# EAGLE design monoblink_pannel (EAGLE 9.0.0)
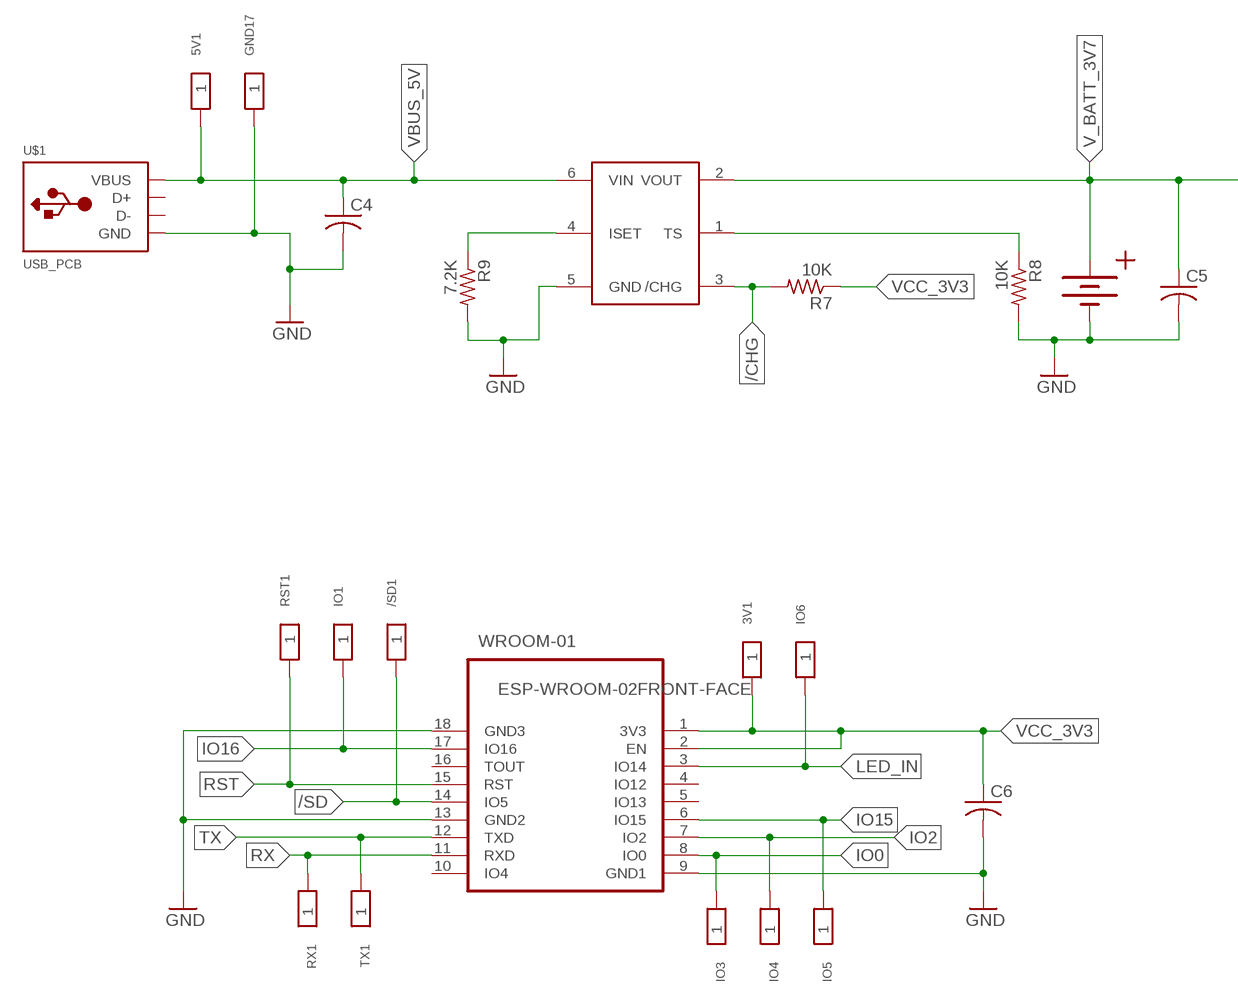
[diagram p0: schematic, sheet 1, part 1 of 2]
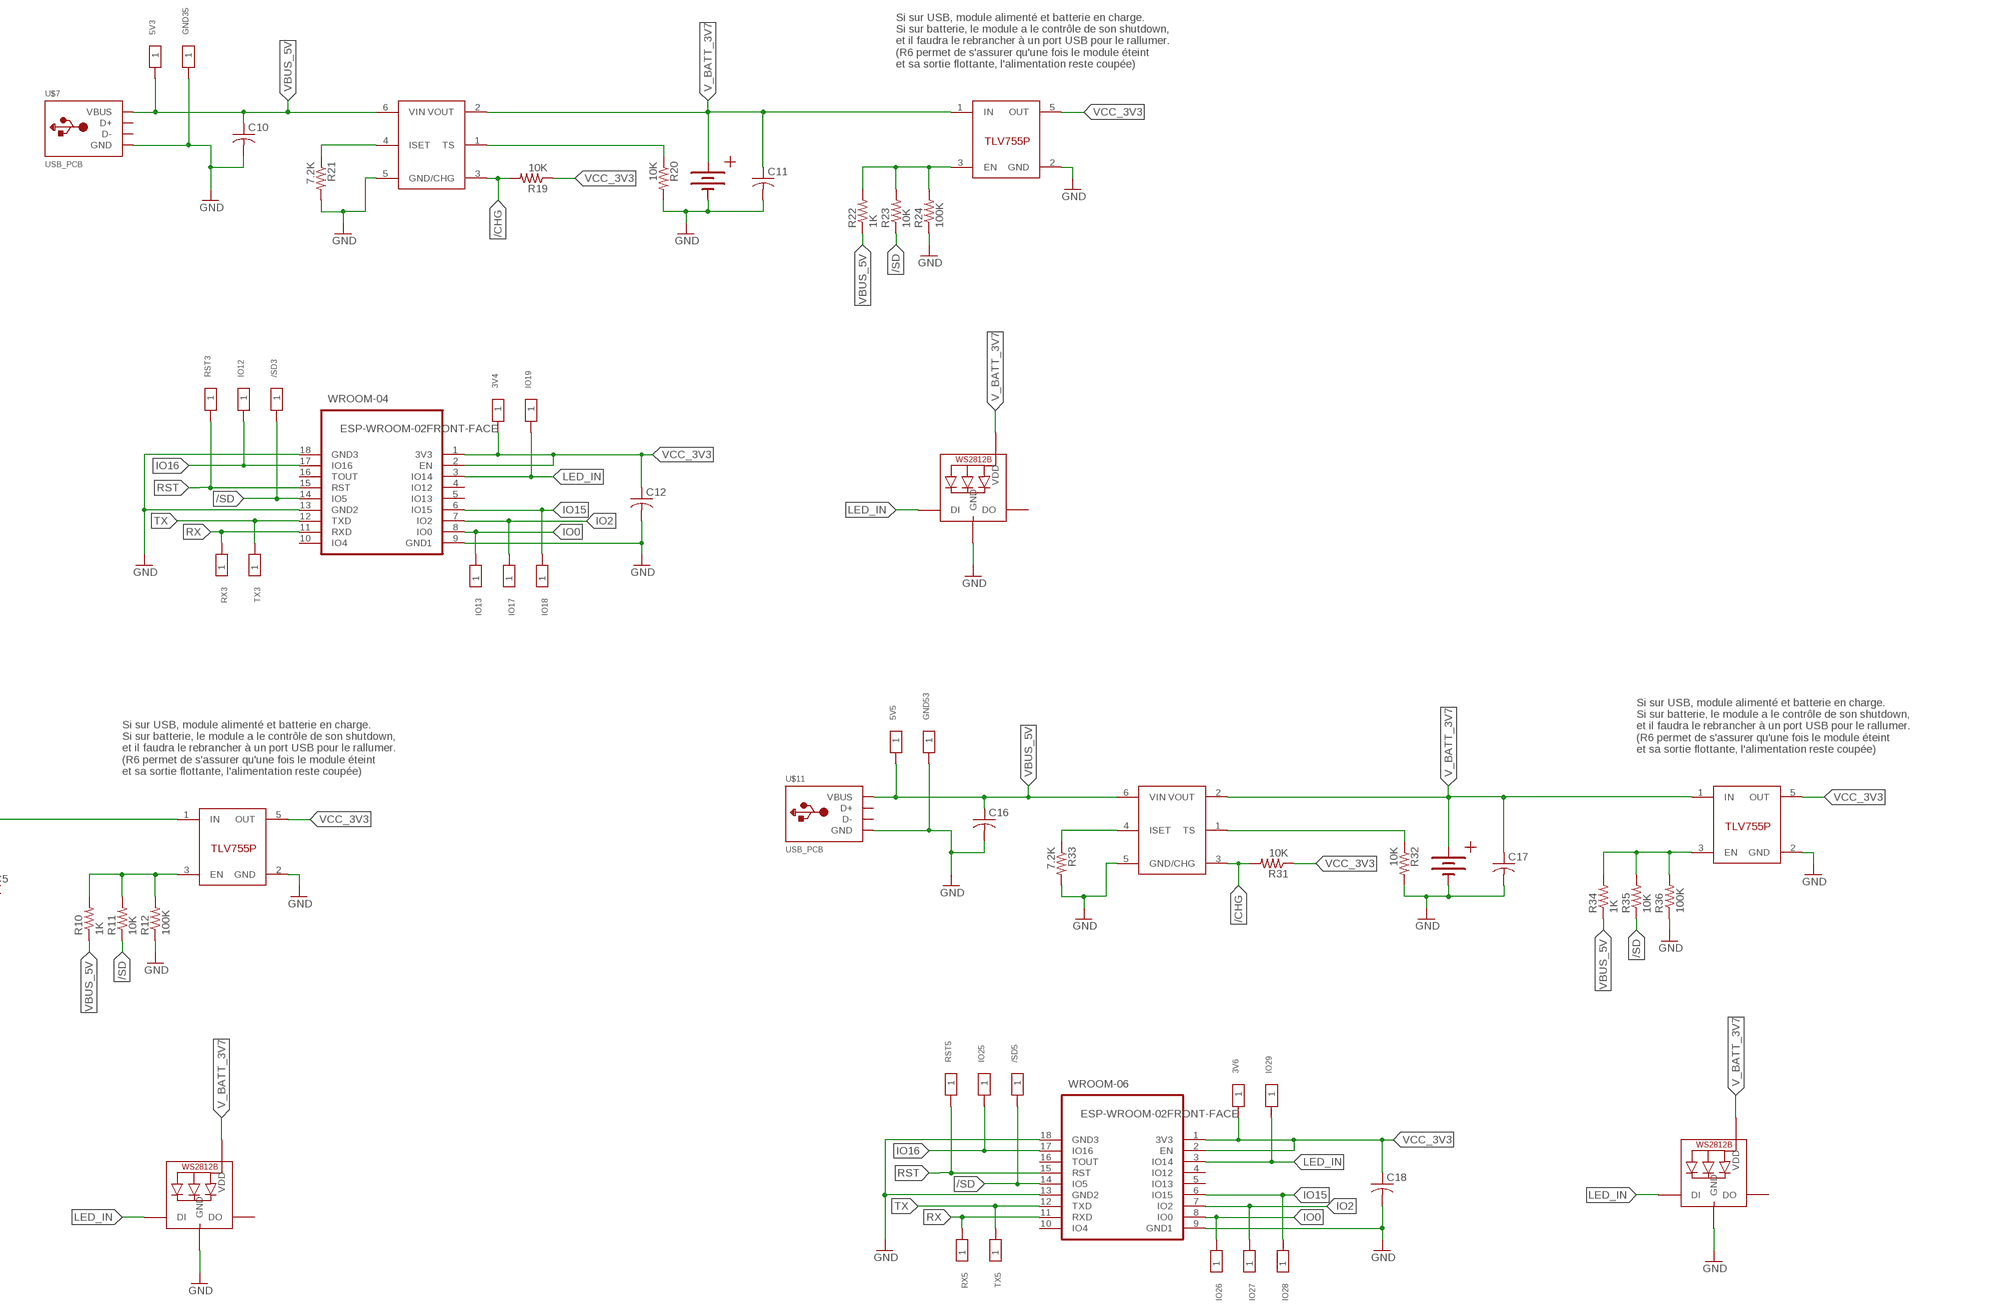
[diagram p1: schematic, sheet 1, part 2 of 2]

## Parts
3V1  TESTPAD_PROG  [TP1.5MM]
3V4  TESTPAD_PROG  [TP1.5MM]
3V6  TESTPAD_PROG  [TP1.5MM]
5V1  TESTPAD_PROG  [TP1.5MM]
5V3  TESTPAD_PROG  [TP1.5MM]
5V5  TESTPAD_PROG  [TP1.5MM]
/SD1  TESTPAD_PROG  [TP1.5MM]
/SD3  TESTPAD_PROG  [TP1.5MM]
/SD5  TESTPAD_PROG  [TP1.5MM]
C4  C-USC0603  [C0603]
C5  C-USC0603  [C0603]
C6  C-USC0603  [C0603]
C10  C-USC0603  [C0603]
C11  C-USC0603  [C0603]
C12  C-USC0603  [C0603]
C16  C-USC0603  [C0603]
C17  C-USC0603  [C0603]
C18  C-USC0603  [C0603]
CHG1  BQ21040  [SOT23-6]
CHG3  BQ21040  [SOT23-6]
CHG5  BQ21040  [SOT23-6]
GND17  TESTPAD_PROG  [TP1.5MM]
GND35  TESTPAD_PROG  [TP1.5MM]
GND53  TESTPAD_PROG  [TP1.5MM]
IO1  TESTPAD_PROG  [TP1.5MM]
IO3  TESTPAD_PROG  [TP1.5MM]
IO4  TESTPAD_PROG  [TP1.5MM]
IO5  TESTPAD_PROG  [TP1.5MM]
IO6  TESTPAD_PROG  [TP1.5MM]
IO12  TESTPAD_PROG  [TP1.5MM]
IO13  TESTPAD_PROG  [TP1.5MM]
IO17  TESTPAD_PROG  [TP1.5MM]
IO18  TESTPAD_PROG  [TP1.5MM]
IO19  TESTPAD_PROG  [TP1.5MM]
IO25  TESTPAD_PROG  [TP1.5MM]
IO26  TESTPAD_PROG  [TP1.5MM]
IO27  TESTPAD_PROG  [TP1.5MM]
IO28  TESTPAD_PROG  [TP1.5MM]
IO29  TESTPAD_PROG  [TP1.5MM]
LDO1  TLV755P  [SOT23-5]
LDO3  TLV755P  [SOT23-5]
LDO5  TLV755P  [SOT23-5]
LED1  WS2812B5050  [WS2812B]
LED3  WS2812B5050  [WS2812B]
LED5  WS2812B5050  [WS2812B]
R7  10K  R-US_R0603  [R0603]
R8  10K  R-US_R0603  [R0603]
R9  7.2K  R-US_R0603  [R0603]
R10  1K  R-US_R0603  [R0603]
R11  10K  R-US_R0603  [R0603]
R12  100K  R-US_R0603  [R0603]
R19  10K  R-US_R0603  [R0603]
R20  10K  R-US_R0603  [R0603]
R21  7.2K  R-US_R0603  [R0603]
R22  1K  R-US_R0603  [R0603]
R23  10K  R-US_R0603  [R0603]
R24  100K  R-US_R0603  [R0603]
R31  10K  R-US_R0603  [R0603]
R32  10K  R-US_R0603  [R0603]
R33  7.2K  R-US_R0603  [R0603]
R34  1K  R-US_R0603  [R0603]
R35  10K  R-US_R0603  [R0603]
R36  100K  R-US_R0603  [R0603]
RST1  TESTPAD_PROG  [TP1.5MM]
RST3  TESTPAD_PROG  [TP1.5MM]
RST5  TESTPAD_PROG  [TP1.5MM]
RX1  TESTPAD_PROG  [TP1.5MM]
RX3  TESTPAD_PROG  [TP1.5MM]
RX5  TESTPAD_PROG  [TP1.5MM]
TX1  TESTPAD_PROG  [TP1.5MM]
TX3  TESTPAD_PROG  [TP1.5MM]
TX5  TESTPAD_PROG  [TP1.5MM]
U$1  USB_PCB  [USB_PADS]
U$3  BATT  [BATT_CON]
U$7  USB_PCB  [USB_PADS]
U$8  BATT  [BATT_CON]
U$11  USB_PCB  [USB_PADS]
U$12  BATT  [BATT_CON]
WROOM-01  ESP-WROOM-02FRONT-FACE  [FRONT-FACE]
WROOM-04  ESP-WROOM-02FRONT-FACE  [FRONT-FACE]
WROOM-06  ESP-WROOM-02FRONT-FACE  [FRONT-FACE]

## Nets
/CHG: CHG1.3(/CHG) CHG3.3(/CHG) CHG5.3(/CHG) R7.2 R19.2 R31.2
/SD: /SD1.1 /SD3.1 /SD5.1 R11.1 R23.1 R35.1 WROOM-01.14(IO5) WROOM-04.14(IO5) WROOM-06.14(IO5)
EN1: LDO1.3(EN) R10.2 R11.2 R12.2
EN3: LDO3.3(EN) R22.2 R23.2 R24.2
EN5: LDO5.3(EN) R34.2 R35.2 R36.2
GND: C4.2 C5.2 C6.2 C10.2 C11.2 C12.2 C16.2 C17.2 C18.2 CHG1.5(GND) CHG3.5(GND) CHG5.5(GND) GND17.1 GND35.1 GND53.1 LDO1.2(GND) LDO3.2(GND) LDO5.2(GND) LED1.3-GND(GND) LED3.3-GND(GND) LED5.3-GND(GND) R8.2 R9.2 R12.1 R20.2 R21.2 R24.1 R32.2 R33.2 R36.1 U$1.GND U$3.V-(-) U$7.GND U$8.V-(-) U$11.GND U$12.V-(-) WROOM-01.9(GND1) WROOM-01.13(GND2) WROOM-01.18(GND3) WROOM-04.9(GND1) WROOM-04.13(GND2) WROOM-04.18(GND3) WROOM-06.9(GND1) WROOM-06.13(GND2) WROOM-06.18(GND3)
IO0: IO3.1 IO13.1 IO26.1 WROOM-01.8(IO0) WROOM-04.8(IO0) WROOM-06.8(IO0)
IO2: IO4.1 IO17.1 IO27.1 WROOM-01.7(IO2) WROOM-04.7(IO2) WROOM-06.7(IO2)
IO15: IO5.1 IO18.1 IO28.1 WROOM-01.6(IO15) WROOM-04.6(IO15) WROOM-06.6(IO15)
IO16: IO1.1 IO12.1 IO25.1 WROOM-01.17(IO16) WROOM-04.17(IO16) WROOM-06.17(IO16)
ISET1: CHG1.4(ISET) R9.1
ISET3: CHG3.4(ISET) R21.1
ISET5: CHG5.4(ISET) R33.1
LED_IN: IO6.1 IO19.1 IO29.1 LED1.4-DIN(DI) LED3.4-DIN(DI) LED5.4-DIN(DI) WROOM-01.3(IO14) WROOM-04.3(IO14) WROOM-06.3(IO14)
RST: RST1.1 RST3.1 RST5.1 WROOM-01.15(RST) WROOM-04.15(RST) WROOM-06.15(RST)
RX: RX1.1 RX3.1 RX5.1 WROOM-01.11(RXD) WROOM-04.11(RXD) WROOM-06.11(RXD)
TS1: CHG1.1(TS) R8.1
TS3: CHG3.1(TS) R20.1
TS5: CHG5.1(TS) R32.1
TX: TX1.1 TX3.1 TX5.1 WROOM-01.12(TXD) WROOM-04.12(TXD) WROOM-06.12(TXD)
V_BATT_3V7: C5.1 C11.1 C17.1 CHG1.2(VOUT) CHG3.2(VOUT) CHG5.2(VOUT) LDO1.1(IN) LDO3.1(IN) LDO5.1(IN) LED1.1-VDD(VDD) LED3.1-VDD(VDD) LED5.1-VDD(VDD) U$3.V+(+) U$8.V+(+) U$12.V+(+)
VBUS_5V: 5V1.1 5V3.1 5V5.1 C4.1 C10.1 C16.1 CHG1.6(VIN) CHG3.6(VIN) CHG5.6(VIN) R10.1 R22.1 R34.1 U$1.V_SUPPLY(VBUS) U$7.V_SUPPLY(VBUS) U$11.V_SUPPLY(VBUS)
VCC_3V3: 3V1.1 3V4.1 3V6.1 C6.1 C12.1 C18.1 LDO1.5(OUT) LDO3.5(OUT) LDO5.5(OUT) R7.1 R19.1 R31.1 WROOM-01.1(3V3) WROOM-01.2(EN) WROOM-04.1(3V3) WROOM-04.2(EN) WROOM-06.1(3V3) WROOM-06.2(EN)
Unconnected: LED1.2-DOUT(DO) LED3.2-DOUT(DO) LED5.2-DOUT(DO) U$1.D+ U$1.D- U$7.D+ U$7.D- U$11.D+ U$11.D- WROOM-01.4(IO12) WROOM-01.5(IO13) WROOM-01.10(IO4) WROOM-01.16(TOUT) WROOM-04.4(IO12) WROOM-04.5(IO13) WROOM-04.10(IO4) WROOM-04.16(TOUT) WROOM-06.4(IO12) WROOM-06.5(IO13) WROOM-06.10(IO4) WROOM-06.16(TOUT)

## Notes on the sheet
- Si sur USB, module alimenté et batterie en charge.
  Si sur batterie, le module a le contrôle de son shutdown,
  et il faudra le rebrancher à un port USB pour le rallumer.
  (R6 permet de s'assurer qu'une fois le module éteint
  et sa sortie flottante, l'alimentation reste coupée)
- Si sur USB, module alimenté et batterie en charge.
  Si sur batterie, le module a le contrôle de son shutdown,
  et il faudra le rebrancher à un port USB pour le rallumer.
  (R6 permet de s'assurer qu'une fois le module éteint
  et sa sortie flottante, l'alimentation reste coupée)
- Si sur USB, module alimenté et batterie en charge.
  Si sur batterie, le module a le contrôle de son shutdown,
  et il faudra le rebrancher à un port USB pour le rallumer.
  (R6 permet de s'assurer qu'une fois le module éteint
  et sa sortie flottante, l'alimentation reste coupée)

## Library data of the parts
3V1 3V4 3V6 5V1 5V3 5V5 /SD1 /SD3 /SD5 GND17 GND35 GND53 IO1 IO3-IO6 IO12 IO13 IO17-IO19 IO25-IO29 RST1 RST3 RST5 RX1 RX3 RX5 TX1 TX3 TX5 = monoblink_wifi:TESTPAD_PROG: TESTPAD
C4-C6 C10-C12 C16-C18 = monoblink_wifi:C-US: CAPACITOR, American symbol; SPICEPREFIX: C
CHG1 CHG3 CHG5 = monoblink_wifi:BQ21040
LDO1 LDO3 LDO5 = monoblink_wifi:TLV755P
LED1 LED3 LED5 = monoblink_wifi:WS2812B
R7-R12 R19-R24 R31-R36 = monoblink_wifi:R-US_: RESISTOR, American symbol; SPICEPREFIX: R
U$1 U$7 U$11 = monoblink_wifi:USB_PCB
U$3 U$8 U$12 = monoblink_wifi:BATT
WROOM-01 WROOM-04 WROOM-06 = monoblink_wifi:ESP-WROOM-02: WiFi module - ESP-WROOM-02

## Board
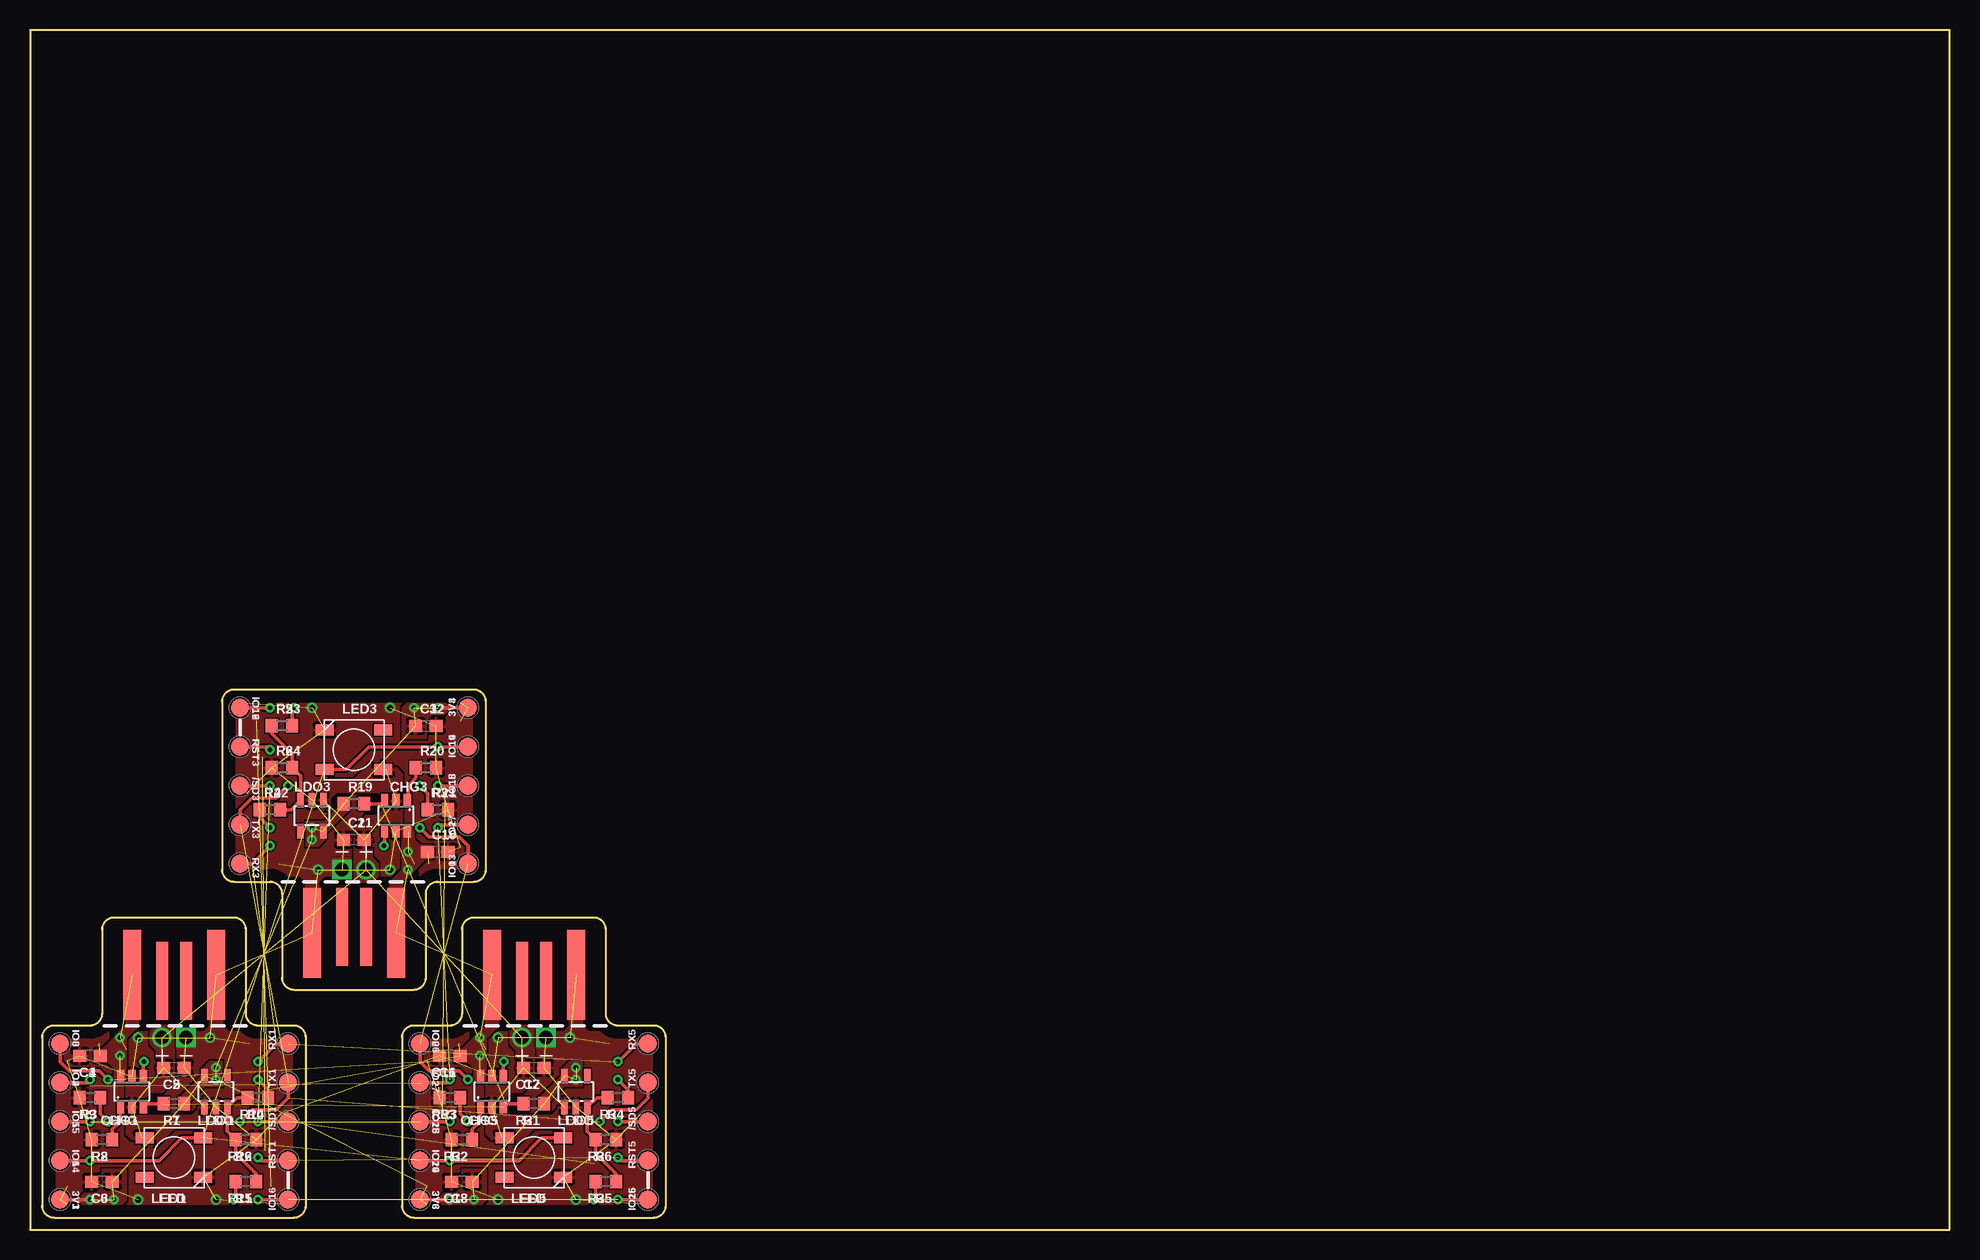
[diagram p2: board, top side]
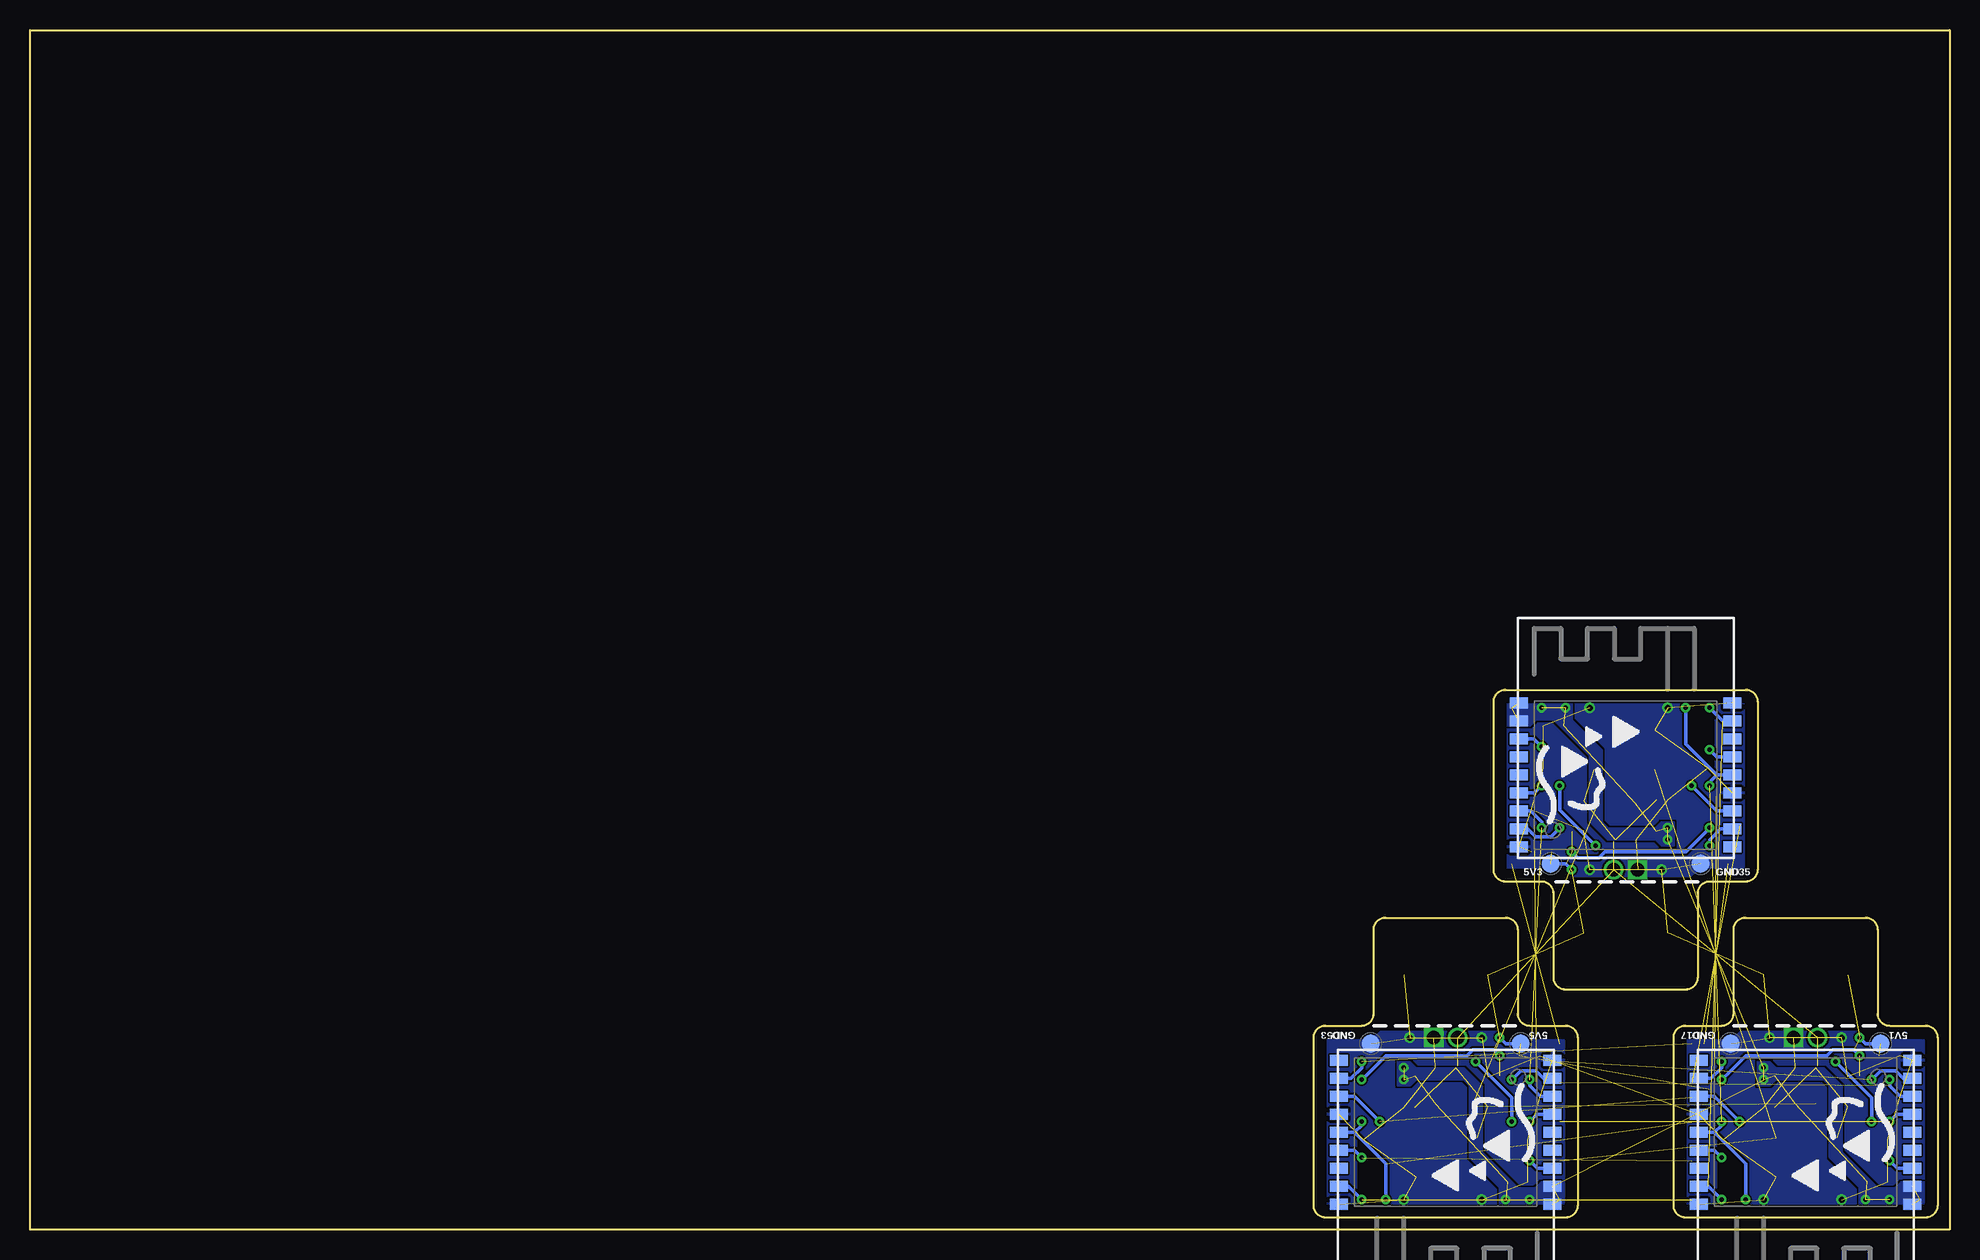
[diagram p3: board, bottom side, seen from below]

Size 160 x 100 mm. Coordinates in mm from the lower left corner, seen from the top.
Outline: 0,0 160,0 160,100 0,100 0,0
Outline: 2,17 arc90 1,16 1,2 arc90 2,1 22,1 arc90 23,2 23,16 arc90 22,17 19,17 arc-90 18,18 18,25 arc90 17,26 7,26 arc90 6,25 6,18 arc-90 5,17 2,17
Outline: 37,29 arc90 38,30 38,44 arc90 37,45 17,45 arc90 16,44 16,30 arc90 17,29 20,29 arc-90 21,28 21,21 arc90 22,20 32,20 arc90 33,21 33,28 arc-90 34,29 37,29
Outline: 32,17 arc90 31,16 31,2 arc90 32,1 52,1 arc90 53,2 53,16 arc90 52,17 49,17 arc-90 48,18 48,25 arc90 47,26 37,26 arc90 36,25 36,18 arc-90 35,17 32,17
Copper layers (1*16): Top 0.035mm / dielectric 1.5mm / Bottom 0.035mm
Design rules "default": minimum track width 6mil, minimum drill 0.35mm, track to track 6mil, track to pad 6mil, pad to pad 6mil, via to via 6mil, smd to smd 6mil, copper to edge 40mil, drill to drill 6mil, minimum pad ring 10mil, minimum via ring 8mil, stop-mask expansion 4mil, vias tented up to drill 0mil, thermal gap 10mil

### Footprints (pad centres in the part's own frame; a part is rotated, then mirrored left to right if it is on the bottom)
TP1.5MM = smd 1.5 x 1.5: 1 0,0
C0603 = smd 1.1 x 1: 1 -0.85,0; 2 0.85,0
SOT23-6 = smd 0.6 x 1.1: 1 -0.95,-1.25; 2 0,-1.25; 3 0.95,-1.25; 4 0.95,1.25; 5 0,1.25; 6 -0.95,1.25
SOT23-5 = smd 0.55 x 1.2: 1 -0.95,-1.3; 2 0,-1.3; 3 0.95,-1.3; 4 0.95,1.3; 5 -0.95,1.3
WS2812B = smd 1.5 x 0.9: 1-VDD 2.45,-1.65; 2-DOUT 2.45,1.65; 3-GND -2.45,1.65; 4-DIN -2.45,-1.65
R0603 = smd 1 x 1.1: 1 -0.85,0; 2 0.85,0
USB_PADS = smd 1 x 6.5: D+ 1,3.25; D- -1,3.25 | smd 1.5 x 7.5: GND 3.5,3.75; V_SUPPLY -3.5,3.75
BATT_CON = drill 1.1 pad 1.6: V+ 0,0 | drill 1.1 pad 1.6 square: V- 2,0
FRONT-FACE = smd 1.485 x 0.9: 1 -8.893,4.9; 2 -8.893,3.4; 3 -8.893,1.9; 4 -8.893,0.4; 5 -8.893,-1.1; 6 -8.893,-2.6; 7 -8.893,-4.1; 8 -8.893,-5.6; 9 -8.893,-7.1; 10 8.893,-7.1; 11 8.893,-5.6; 12 8.893,-4.1; 13 8.893,-2.6; 14 8.893,-1.1; 15 8.893,0.4; 16 8.893,1.9; 17 8.893,3.4; 18 8.893,4.9

### Placement (x,y rotation side)
3V1  2.5,2.5 180 top
3V4  36.5,43.5 0 top
3V6  32.5,2.5 180 top
5V1  5.75,15.5 180 bottom
5V3  33.25,30.5 0 bottom
5V5  35.75,15.5 180 bottom
/SD1  21.5,9 180 top
/SD3  17.5,37 0 top
/SD5  51.5,9 180 top
C4  5,14.5 180 top
C5  12,13.5 0 top
C6  6,4 180 top
C10  34,31.5 0 top
C11  27,32.5 180 top
C12  33,42 0 top
C16  35,14.5 180 top
C17  42,13.5 0 top
C18  36,4 180 top
CHG1  8.5,11.5 0 top
CHG3  30.5,34.5 180 top
CHG5  38.5,11.5 0 top
GND17  18.25,15.5 180 bottom
GND35  20.75,30.5 0 bottom
GND53  48.25,15.5 180 bottom
IO1  21.5,2.5 180 top
IO3  2.5,15.5 180 top
IO4  2.5,12.25 180 top
IO5  2.5,9 180 top
IO6  2.5,5.75 180 top
IO12  17.5,43.5 0 top
IO13  36.5,30.5 0 top
IO17  36.5,33.75 0 top
IO18  36.5,37 0 top
IO19  36.5,40.25 0 top
IO25  51.5,2.5 180 top
IO26  32.5,15.5 180 top
IO27  32.5,12.25 180 top
IO28  32.5,9 180 top
IO29  32.5,5.75 180 top
LDO1  15.5,11.5 0 top
LDO3  23.5,34.5 180 top
LDO5  45.5,11.5 0 top
LED1  12,6 180 top
LED3  27,40 0 top
LED5  42,6 180 top
R7  12,10.5 180 top
R8  6,7.5 180 top
R9  5,11 180 top
R10  19,11 180 top
R11  18,4 0 top
R12  18,7.5 180 top
R19  27,35.5 0 top
R20  33,38.5 0 top
R21  34,35 0 top
R22  20,35 0 top
R23  21,42 180 top
R24  21,38.5 0 top
R31  42,10.5 180 top
R32  36,7.5 180 top
R33  35,11 180 top
R34  49,11 180 top
R35  48,4 0 top
R36  48,7.5 180 top
RST1  21.5,5.75 180 top
RST3  17.5,40.25 0 top
RST5  51.5,5.75 180 top
RX1  21.5,15.5 180 top
RX3  17.5,30.5 0 top
RX5  51.5,15.5 180 top
TX1  21.5,12.25 180 top
TX3  17.5,33.75 0 top
TX5  51.5,12.25 180 top
U$1  12,17.5 0 top
U$3  11,16 0 top
U$7  27,28.5 180 top
U$8  28,30 180 top
U$11  42,17.5 0 top
U$12  41,16 0 top
WROOM-01  12,7 180 bottom
WROOM-04  27,39 0 bottom
WROOM-06  42,7 180 bottom

### Tracks (layer width: path | path; a pad name or v marks a point on that pad's centre or on a via)
/CHG  (2 unrouted)
  Top 0.305: R7.2 9.7,10.5 CHG1.3 | R19.2 29.3,35.5 CHG3.3 | R31.2 39.7,10.5 CHG5.3
/SD  (via drill 0.35)  (2 unrouted)
  Top 0.305: R11.1 17.15,2.85 v17,2.5 | /SD1.1 v19,9 | R23.1 21.85,43.15 v22,43.5 | /SD3.1 v20,37 | R35.1 47.15,2.85 v47,2.5 | /SD5.1 v49,9
  Bottom 0.305: v17,2.5 17,5.5 19.6,8.1 | 19.6,8.1 WROOM-01.14 | 19.6,8.1 19,8.7 v19,9 | v22,43.5 22,40.5 19.4,37.9 | 19.4,37.9 WROOM-04.14 | 19.4,37.9 20,37.3 v20,37 | v47,2.5 47,5.5 49.6,8.1 | 49.6,8.1 WROOM-06.14 | 49.6,8.1 49,8.7 v49,9
EN1
  Top 0.305: R10.2 17.25,11 LDO1.3 16.45,8.2 R12.2 17.15,6.35 18.85,4.65 R11.2
EN3
  Top 0.305: R22.2 21.75,35 LDO3.3 22.55,37.8 R24.2 21.85,39.65 20.15,41.35 R23.2
EN5
  Top 0.305: R34.2 47.25,11 LDO5.3 46.45,8.2 R36.2 47.15,6.35 48.85,4.65 R35.2
GND  (via drill 0.5 pad 0.7)  (56 unrouted)
  other vias: 15,16 15.5,2.5 9,2.5 9,16 24,30 23.5,43.5 30,43.5 30,30 45,16 45.5,2.5 39,2.5 39,16
  pour Top (rank 2): 22.5,1.5 1.5,1.5 1.5,16.5 6.5,16.5 6.5,15 17.5,15 17.5,16.5 22.5,16.5
  pour Bottom (rank 2, no thermals): 19.5,1.5 4.5,1.5 4.5,16.5 19.5,16.5
  pour Bottom (rank 2): 19.5,1.5 22.5,1.5 22.5,16.5 19.5,16.5
  pour Bottom (rank 2): 1.5,1.5 4.5,1.5 4.5,16.5 1.5,16.5
  pour Top (rank 2, no thermals): 17.5,16.5 17.5,15 6.5,15 6.5,16.5 14.5,16.5 15,17 15,17.5 16,17.5 16,17 16.5,16.5
  pour Top (rank 2): 16.5,44.5 37.5,44.5 37.5,29.5 32.5,29.5 32.5,31 21.5,31 21.5,29.5 16.5,29.5
  pour Bottom (rank 2, no thermals): 19.5,44.5 34.5,44.5 34.5,29.5 19.5,29.5
  pour Bottom (rank 2): 19.5,44.5 16.5,44.5 16.5,29.5 19.5,29.5
  pour Bottom (rank 2): 37.5,44.5 34.5,44.5 34.5,29.5 37.5,29.5
  pour Top (rank 2, no thermals): 21.5,29.5 21.5,31 32.5,31 32.5,29.5 24.5,29.5 24,29 24,28.5 23,28.5 23,29 22.5,29.5
  pour Top (rank 2): 52.5,1.5 31.5,1.5 31.5,16.5 36.5,16.5 36.5,15 47.5,15 47.5,16.5 52.5,16.5
  pour Bottom (rank 2, no thermals): 49.5,1.5 34.5,1.5 34.5,16.5 49.5,16.5
  pour Bottom (rank 2): 49.5,1.5 52.5,1.5 52.5,16.5 49.5,16.5
  pour Bottom (rank 2): 31.5,1.5 34.5,1.5 34.5,16.5 31.5,16.5
  pour Top (rank 2, no thermals): 47.5,16.5 47.5,15 36.5,15 36.5,16.5 44.5,16.5 45,17 45,17.5 46,17.5 46,17 46.5,16.5
IO0  (via drill 0.35)  (2 unrouted)
  Top 0.305: IO3.1 2.5,14 3.25,13.25 5.75,13.25 v6.5,12.5 | IO13.1 36.5,32 35.75,32.75 33.25,32.75 v32.5,33.5 | IO26.1 32.5,14 33.25,13.25 35.75,13.25 v36.5,12.5
  Bottom 0.305: 3.21,12.5 WROOM-01.8 3.85,12.6 4.5,13.25 5.75,13.25 v6.5,12.5 | 35.79,33.5 WROOM-04.8 35.15,33.4 34.5,32.75 33.25,32.75 v32.5,33.5 | 33.21,12.5 WROOM-06.8 33.85,12.6 34.5,13.25 35.75,13.25 v36.5,12.5
IO2  (via drill 0.35)  (2 unrouted)
  Top 0.305: v5,12.5 4.75,12.25 IO4.1 | v34,33.5 34.25,33.75 IO17.1 | v35,12.5 34.75,12.25 IO27.1
  Bottom 0.305: WROOM-01.7 4.1,11.1 5,12 v5,12.5 | WROOM-04.7 34.9,34.9 34,34 v34,33.5 | WROOM-06.7 34.1,11.1 35,12 v35,12.5
IO15  (via drill 0.35)  (2 unrouted)
  Top 0.305: v5,9 IO5.1 | v34,37 IO18.1 | v35,9 IO28.1
  Bottom 0.305: WROOM-01.6 4.4,9.6 v5,9 | WROOM-04.6 34.6,36.4 v34,37 | WROOM-06.6 34.4,9.6 v35,9
IO16  (via drill 0.35)  (2 unrouted)
  Top 0.305: v19,2.5 IO1.1 | v20,43.5 IO12.1 | v49,2.5 IO25.1
  Bottom 0.305: WROOM-01.17 20.1,3.6 v19,2.5 | WROOM-04.17 18.9,42.4 v20,43.5 | WROOM-06.17 50.1,3.6 v49,2.5
ISET1  (via drill 0.35)
  Top 0.305: 6,10.65 R9.1 5.85,9.65 v6.5,9 | v9.5,14 9.45,13.95 CHG1.4
  Bottom 0.305: v9.5,14 6.5,11 v6.5,9
ISET3  (via drill 0.35)
  Top 0.305: 33,35.35 R21.1 33.15,36.35 v32.5,37 | v29.5,32 29.55,32.05 CHG3.4
  Bottom 0.305: v29.5,32 32.5,35 v32.5,37
ISET5  (via drill 0.35)
  Top 0.305: 36,10.65 R33.1 35.85,9.65 v36.5,9 | v39.5,14 39.45,13.95 CHG5.4
  Bottom 0.305: v39.5,14 36.5,11 v36.5,9
LED_IN  (via drill 0.35)  (2 unrouted)
  Top 0.305: LED1.4-DIN 12.65,7.65 10.75,5.75 v5,5.75 IO6.1 | LED3.4-DIN 26.35,38.35 28.25,40.25 v34,40.25 IO19.1 | LED5.4-DIN 42.65,7.65 40.75,5.75 v35,5.75 IO29.1
  Bottom 0.305: 3.21,5 WROOM-01.3 4.35,5.1 v5,5.75 | 35.79,41 WROOM-04.3 34.65,40.9 v34,40.25 | 33.21,5 WROOM-06.3 34.35,5.1 v35,5.75
RST  (via drill 0.35)  (2 unrouted)
  Top 0.305: v19,6 19.25,5.75 RST1.1 | v20,40 19.75,40.25 RST3.1 | v49,6 49.25,5.75 RST5.1
  Bottom 0.305: v19,6 19.6,6.6 WROOM-01.15 | v20,40 19.4,39.4 WROOM-04.15 | v49,6 49.6,6.6 WROOM-06.15
RX  (via drill 0.35)  (2 unrouted)
  Top 0.305: RX1.1 20.5,15.5 v19,14 | RX3.1 18.5,30.5 v20,32 | RX5.1 50.5,15.5 v49,14
  Bottom 0.305: WROOM-01.11 19.9,12.6 19,13.5 v19,14 | WROOM-04.11 19.1,33.4 20,32.5 v20,32 | WROOM-06.11 49.9,12.6 49,13.5 v49,14
TS1
  Top 0.305: CHG1.1 7.5,10.2 7.5,9 6.85,8.35 R8.1
TS3
  Top 0.305: CHG3.1 31.5,35.8 31.5,37 32.15,37.65 R20.1
TS5
  Top 0.305: CHG5.1 37.5,10.2 37.5,9 36.85,8.35 R32.1
TX  (via drill 0.35)  (2 unrouted)
  Top 0.305: TX1.1 21.5,11 20.5,10 18.5,10 v17.5,9 | TX3.1 17.5,35 18.5,36 20.5,36 v21.5,37 | TX5.1 51.5,11 50.5,10 48.5,10 v47.5,9
  Bottom 0.305: WROOM-01.12 19.6,11.1 v17.5,9 | WROOM-04.12 19.4,34.9 v21.5,37 | WROOM-06.12 49.6,11.1 v47.5,9
V_BATT_3V7  (14 unrouted)
  Top 0.305: LED1.1-VDD 9.35,7.65 | 11,13.65 C5.1 | LED3.1-VDD 29.65,38.35 | 28,32.35 C11.1 | LED5.1-VDD 39.35,7.65 | 41,13.65 C17.1
  pour Top: 15,9.5 15,11 14,11 14,10 13.5,9.5 9,9.5 9,11 9.5,11 10,11.5 11,11.5 12,12.5 12,17 10.5,17 10,16.5 10,15.5 10.5,15 10.5,12.5 10,12 8,12 8,8 9,7 10.5,7 12,8.5 14,8.5
  pour Top: 24,36.5 24,35 25,35 25,36 25.5,36.5 30,36.5 30,35 29.5,35 29,34.5 28,34.5 27,33.5 27,29 28.5,29 29,29.5 29,30.5 28.5,31 28.5,33.5 29,34 31,34 31,38 30,39 28.5,39 27,37.5 25,37.5
  pour Top: 45,9.5 45,11 44,11 44,10 43.5,9.5 39,9.5 39,11 39.5,11 40,11.5 41,11.5 42,12.5 42,17 40.5,17 40,16.5 40,15.5 40.5,15 40.5,12.5 40,12 38,12 38,8 39,7 40.5,7 42,8.5 44,8.5
VBUS_5V  (via drill 0.35)  (14 unrouted)
  Top 0.305: 7.5,12.8 CHG1.6 | R10.1 19.85,11.65 v19,12.5 | 31.5,33.2 CHG3.6 | R22.1 19.15,34.35 v20,33.5 | 37.5,12.8 CHG5.6 | R34.1 49.85,11.65 v49,12.5
  Bottom 0.305: v19,12.5 17,14.5 10.25,14.5 9.75,15 8,15 v7.5,14.5 | v7.5,16 7,15.5 5V1.1 | v20,33.5 22,31.5 28.75,31.5 29.25,31 31,31 v31.5,31.5 | v31.5,30 32,30.5 5V3.1 | v49,12.5 47,14.5 40.25,14.5 39.75,15 38,15 v37.5,14.5 | v37.5,16 37,15.5 5V5.1
  pour Top (no thermals): 9,24.5 8,24.5 8,17 6,15 5.5,15 5.5,14 6.5,14 7,13.5 7,12.5 8,12.5 8,16 9,17
  pour Top (no thermals): 30,21.5 31,21.5 31,29 33,31 33.5,31 33.5,32 32.5,32 32,32.5 32,33.5 31,33.5 31,30 30,29
  pour Top (no thermals): 39,24.5 38,24.5 38,17 36,15 35.5,15 35.5,14 36.5,14 37,13.5 37,12.5 38,12.5 38,16 39,17
VCC_3V3  (via drill 0.35)  (26 unrouted)
  Top 0.305: v5,2.5 3V1.1 | v34,43.5 3V4.1 | v35,2.5 3V6.1
  other vias: 7,2.5 15.5,13.5 15.5,12.5 32,43.5 23.5,32.5 23.5,33.5 37,2.5 45.5,13.5 45.5,12.5
  pour Bottom (no thermals): 2,4 2,1.5 7,1.5 7.5,2 7.5,3.5 10,6 10,12 10.5,12.5 14.5,12.5 15,12 16,12 16,14 15,14 14.5,13.5 10.5,13.5 9,12 9,6.5 6,3.5 4.5,3.5 4,4
  pour Top (no thermals): 8,3 4.5,3 4,2.5 4.5,2 7.5,2 8,2.5
  pour Top (no thermals): 16,12 16,14 15,14 14.5,13.5 14.5,13 12.5,11 12.5,10 13,10 13,10.5 14.5,12
  pour Top: 8,3 8,5 6,5 6,3.5 5.5,3
  pour Bottom (no thermals): 37,42 37,44.5 32,44.5 31.5,44 31.5,42.5 29,40 29,34 28.5,33.5 24.5,33.5 24,34 23,34 23,32 24,32 24.5,32.5 28.5,32.5 30,34 30,39.5 33,42.5 34.5,42.5 35,42
  pour Top (no thermals): 31,43 34.5,43 35,43.5 34.5,44 31.5,44 31,43.5
  pour Top (no thermals): 23,34 23,32 24,32 24.5,32.5 24.5,33 26.5,35 26.5,36 26,36 26,35.5 24.5,34
  pour Top: 31,43 31,41 33,41 33,42.5 33.5,43
  pour Bottom (no thermals): 32,4 32,1.5 37,1.5 37.5,2 37.5,3.5 40,6 40,12 40.5,12.5 44.5,12.5 45,12 46,12 46,14 45,14 44.5,13.5 40.5,13.5 39,12 39,6.5 36,3.5 34.5,3.5 34,4
  pour Top (no thermals): 38,3 34.5,3 34,2.5 34.5,2 37.5,2 38,2.5
  pour Top (no thermals): 46,12 46,14 45,14 44.5,13.5 44.5,13 42.5,11 42.5,10 43,10 43,10.5 44.5,12
  pour Top: 38,3 38,5 36,5 36,3.5 35.5,3

### Text on the board
_tNames: IO16 | R5 | LED | C3 | 3V3 | RST | R6 | R2 | IO14 | /SD | R4 | LDO | R1 | CHG | R3 | IO15 | TX | C2 | IO2 | C1 | RX | IO0 | IO0 | IO0 | RX | RX | C1 | C1 | IO2 | C2 | IO2 | C2 | TX | TX | IO15 | R3 | CHG | R1 | LDO | R4 | IO15 | R3 | CHG | R1 | LDO | R4 | /SD | /SD | IO14 | IO14 | R2 | R6 | R2 | R6 | RST | RST | 3V3 | C3 | LED | R5 | 3V3 | C3 | LED | R5 | IO16 | IO16
_bNames: GND | 5V | 5V | GND | 5V | GND